# Altium schematic sheet P04_ USB.SchDoc
size A4; SheetNumber: 4; SheetTotal: 7
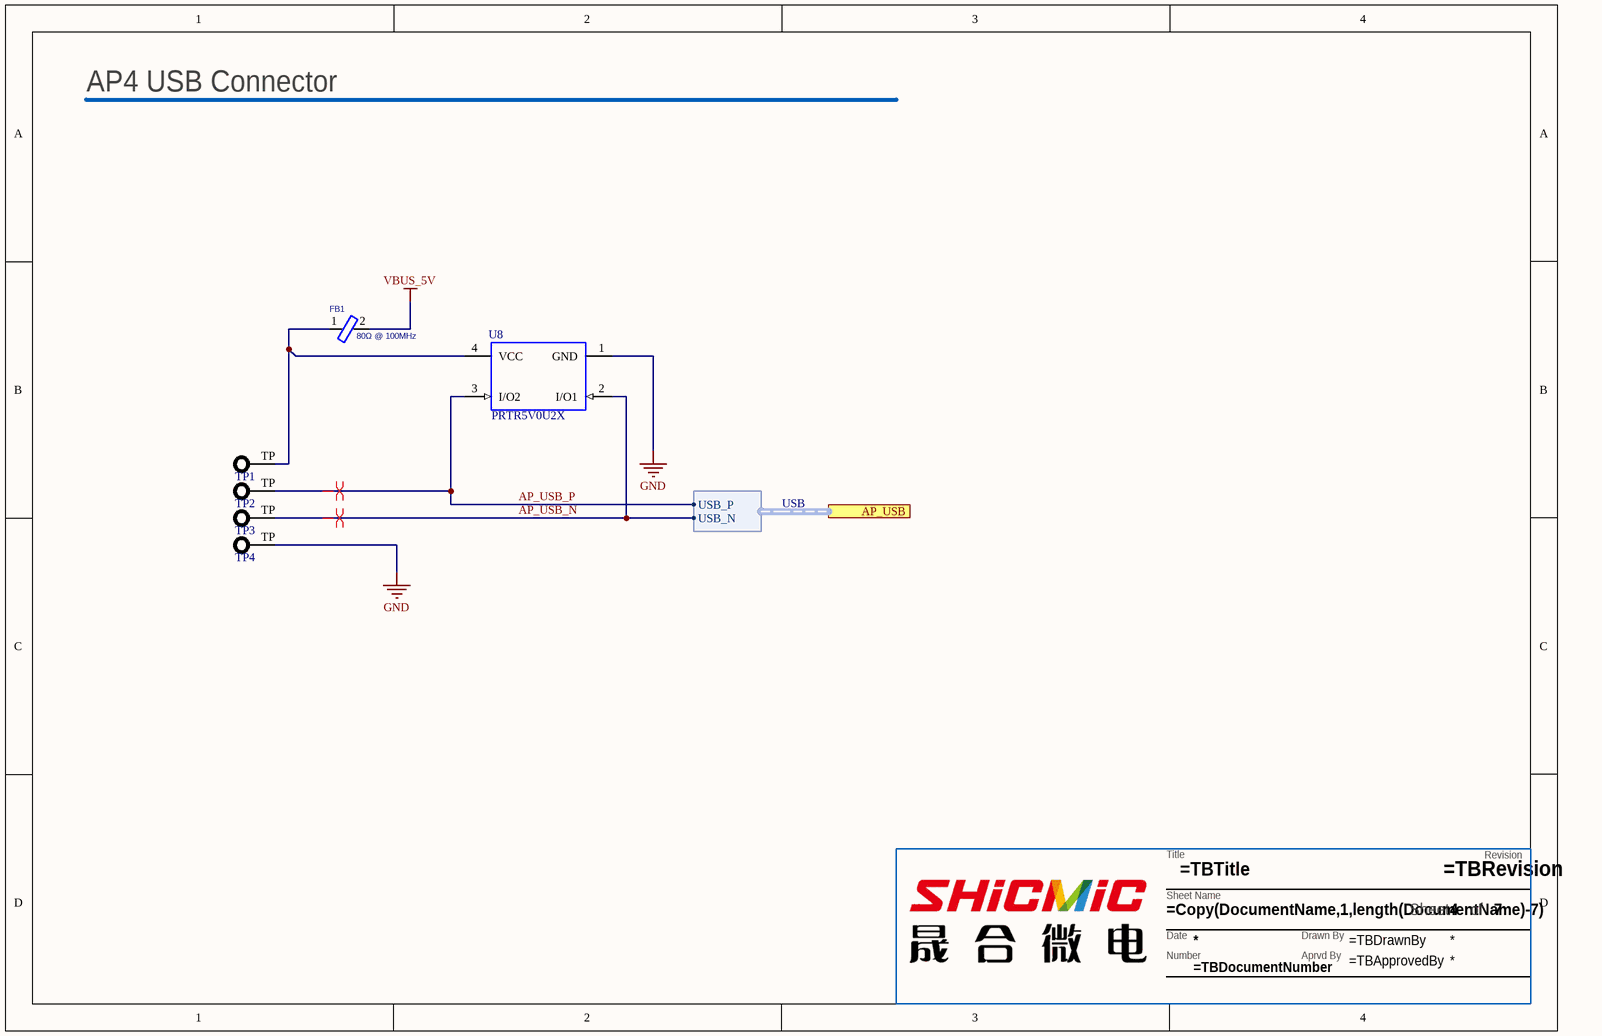
[diagram p0: P04_ USB.SchDoc]

## Parts
?  TitleBlock  (value not drawn)  (graphical)
FB1  80Ω @ 100MHz  [IPC_A]
TP1  PAD  [TPPAD_1.5mm]  (value not drawn)  (no BOM)
TP2  PAD  [TPPAD_1.5mm]  (value not drawn)  (no BOM)
TP3  PAD  [TPPAD_1.5mm]  (value not drawn)  (no BOM)
TP4  PAD  [TPPAD_1.5mm]  (value not drawn)  (no BOM)
U8  PRTR5V0U2X  [SOT143L]

## Ports
AP_USB (harness USB)

## Harnesses
USB: USB_N, USB_P

## Nets
GND: TP4.TP U8.1(GND)
VBUS_5V: FB1.2
AP_USB_N: TP3.TP U8.2(I/O1) ; port AP_USB.USB_N
AP_USB_P: TP2.TP U8.3(I/O2) ; port AP_USB.USB_P
NetFB1_1: FB1.1 TP1.TP U8.4(VCC)

## Layout directives
differential pair: AP_USB_N, AP_USB_P

## Notes on the sheet
- AP4 USB Connector
- (in symbol TitleBlock) Revision; Title; Sheet Name; Sheet; of; Date; Drawn By; Number; Aprvd By

## Library data of the parts
? = TitleBlock: Title block for Ambiq Schematics. Please have the following parameters entered in Project>Project Options>Parameters: / TBTitle / TBDocumentNumber / TBRevision / TBDrawnBy / TBApprovedBy; AMBIQ PN: TitleBlock
FB1 = Ferrite: NONE; Manufacturer: Taiyo Yuden; AMBIQ PN: FBMJ3216HS800-T; Impedance: 80R; Tolerance: 25%; DC Resistance (DCR): 10mR; Max DC Current: 4A; Number of Lines: 1; Shielding: Unshielded; Supplier 1: Newark; Supplier Part Number 1: 86H5353; Manufacturer Part Number: FBMJ3216HS800-T; RoHS: Yes; Category: Ferrite Beads and Chips; Stock 1: 265; Pricing 1: 1=0.30000, 10=0.20700, 25=0.17700, 50=0.14800, 100=0.11800 (USD); ComponentLink1URL: https://datasheet.ciiva.com/5709/chipbeads01-e-5709344.pdf?src-supplier=Farnell; ComponentLink1Description: https://datasheet.ciiva.com/5709/chipbeads01-e-5709344.pdf?src-supplier=Farnell; Mount: Surface Mount; Case/Package: 1206; Number of Pins: 2; Core Material: Ferrite; Case Code (Metric): 3216; Case Code (Imperial): 1206; Material: Ferrite; Min Operating Temperature: -40°C; Max Operating Temperature: 125°C; Packaging: Tape and Reel; Resistance: 10mR; Package Quantity: 1; Max Current Rating: 4A; Termination: SMD/SMT; Test Frequency: 100MHz; Frequency: 100MHz; Series: FB; Resistor Type: Ferrite Bead; Length: 3.2mm; Width: 0.063inch; Height: 1.3mm; Depth: 1.8mm; Lead Free: Lead Free; Halogen Free: Halogen Free; REACH SVHC: No SVHC; ComponentLink2URL: https://datasheet.ciiva.com/16001/202fbmj3216hs800-t-16001070.pdf?src-supplier=Onlinecomponents.com; ComponentLink2Description: https://datasheet.ciiva.com/16001/202fbmj3216hs800-t-16001070.pdf?src-supplier=Onlinecomponents.com; ComponentLink3URL: https://datasheet.ciiva.com/30088/23fbmj3216hs800-t-30088710.pdf?src-supplier=Onlinecomponents.com; ComponentLink3Description: https://datasheet.ciiva.com/30088/23fbmj3216hs800-t-30088710.pdf?src-supplier=Onlinecomponents.com; ComponentLink4URL: https://datasheet.ciiva.com/23606/fbmj3216hs800-t-ss-23606768.pdf?src-supplier=Newark; ComponentLink4Description: https://datasheet.ciiva.com/23606/fbmj3216hs800-t-ss-23606768.pdf?src-supplier=Newark; ComponentLink5URL: https://datasheet.ciiva.com/25614/0900766b810b37be-25614395.pdf?src-supplier=RSComponents; ComponentLink5Description: https://datasheet.ciiva.com/25614/0900766b810b37be-25614395.pdf?src-supplier=RSComponents; ComponentLink6URL: https://datasheet.ciiva.com/6212/chipbeads01-e-6212909.pdf?src-supplier=Digi-Key; ComponentLink6Description: https://datasheet.ciiva.com/6212/chipbeads01-e-6212909.pdf?src-supplier=Digi-Key; ComponentLink7URL: https://datasheet.ciiva.com/7966/chipbeads01-e-7966171.pdf?src-supplier=Element14; ComponentLink7Description: https://datasheet.ciiva.com/7966/chipbeads01-e-7966171.pdf?src-supplier=Element14
TP1-TP4 = TP_PAD: None; AMBIQ PN: TP_PAD
U8 = PRTR5V0U2X: None; Manufacturer: Nexperia; AMBIQ PN: PRTR5V0U2X,215; Manufacturer Part Number: PRTR5V0U2X,215; Supplier 1: Arrow Electronics; Supplier Part Number 1: PRTR5V0U2X,215; RoHS: Yes; Category: ESD and Circuit Protection ICs; Stock 1: 234000; Pricing 1: 3000=0.18050, 6000=0.16890, 15000=0.15880 (USD); RoHS Compliant: Yes; ComponentLink1URL: http://www.farnell.com/datasheets/109718.pdf?src-supplier=Farnell; ComponentLink1Description: http://www.farnell.com/datasheets/109718.pdf?src-supplier=Farnell; ComponentLink2URL: https://assets.nexperia.com/documents/data-sheet/PRTR5V0U2X.pdf?src-supplier=Digi-Key; ComponentLink2Description: https://assets.nexperia.com/documents/data-sheet/PRTR5V0U2X.pdf?src-supplier=Digi-Key